# Altium schematic sheet MotorCellTwo.SchDoc: ODRIVE-FOC
size A3; DocumentNumber: SEASKY; Revision: V1.1
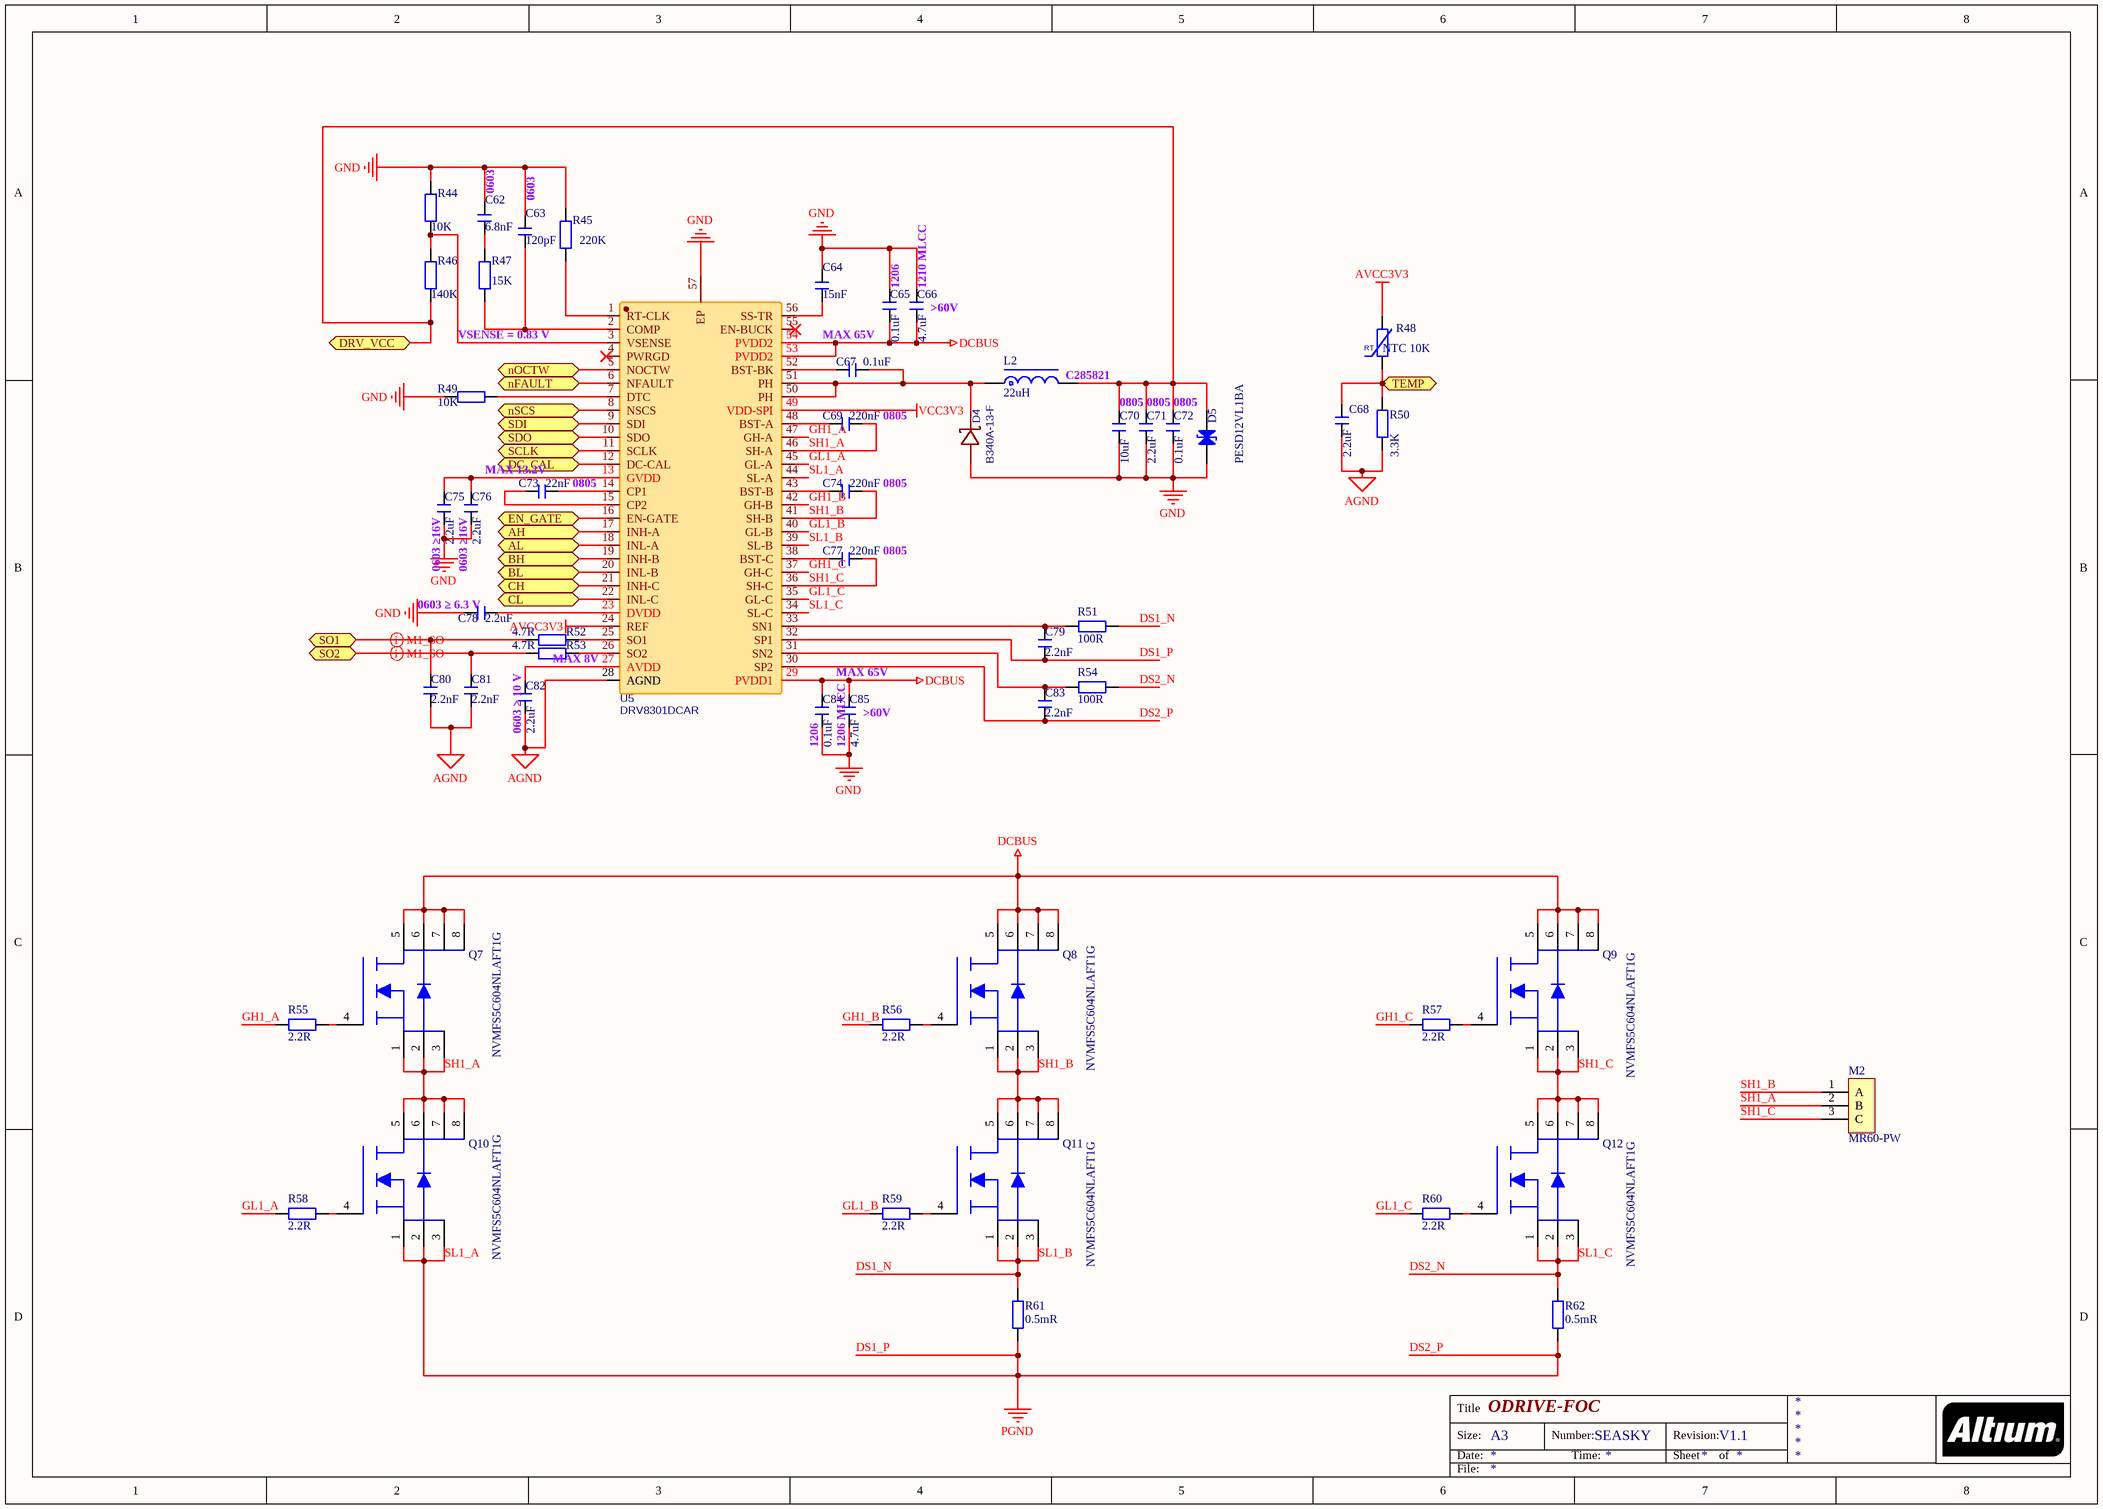
[diagram p0: MotorCellTwo.SchDoc]

## Parts
C62  6.8nF  [C 0603_L]
C63  120pF  [C 0603_L]
C64  15nF  [C 0603_L]
C65  0.1uF  [C 1206_L]
C66  4.7uF  [C 1210_L]
C67  0.1uF  [C 0603_L]
C68  2.2uF  [C 0603_L]
C69  220nF  [C 0805_L]
C70  10uF  [C 0805_L]
C71  2.2uF  [C 0805_L]
C72  0.1uF  [C 0805_L]
C73  22nF  [C 0805_L]
C74  220nF  [C 0805_L]
C75  2.2uF  [C 0603_L]
C76  2.2uF  [C 0603_L]
C77  220nF  [C 0805_L]
C78  2.2uF  [C 0603_L]
C79  2.2nF  [C 0603_L]
C80  2.2nF  [C 0603_L]
C81  2.2nF  [C 0603_L]
C82  2.2uF  [C 0603_L]
C83  2.2nF  [C 0603_L]
C84  0.1uF  [C 1206_L]
C85  4.7uF  [C 1210_L]
D4  B340A-13-F  [SMA_L4.4-W2.6-LS5.0-RD]
D5  PESD12VL1BA  [SOD-323]
L2  22uH  [CD53]
M2  MR60-PW  [MR60-PW]
Q7  NVMFS5C604NLAFT1G  [PG-TDSON-8_L5.0-W6.0-P1.27-LS6.2-BL-EP]
Q8  NVMFS5C604NLAFT1G  [PG-TDSON-8_L5.0-W6.0-P1.27-LS6.2-BL-EP]
Q9  NVMFS5C604NLAFT1G  [PG-TDSON-8_L5.0-W6.0-P1.27-LS6.2-BL-EP]
Q10  NVMFS5C604NLAFT1G  [PG-TDSON-8_L5.0-W6.0-P1.27-LS6.2-BL-EP]
Q11  NVMFS5C604NLAFT1G  [PG-TDSON-8_L5.0-W6.0-P1.27-LS6.2-BL-EP]
Q12  NVMFS5C604NLAFT1G  [PG-TDSON-8_L5.0-W6.0-P1.27-LS6.2-BL-EP]
R44  10K  [R 0603_L]
R45  220K  [R 0603_L]
R46  140K  [R 0603_L]
R47  15K  [R 0603_L]
R48  NTC 10K  [R 0805-HP_L]
R49  10K  [R 0603_L]
R50  3.3K  [R 0805_L]
R51  100R  [R 0603_L]
R52  4.7R  [R 0603_L]
R53  4.7R  [R 0603_L]
R54  100R  [R 0603_L]
R55  2.2R  [R 0603_L]
R56  2.2R  [R 0603_L]
R57  2.2R  [R 0603_L]
R58  2.2R  [R 0603_L]
R59  2.2R  [R 0603_L]
R60  2.2R  [R 0603_L]
R61  0.5mR  [R3920]
R62  0.5mR  [R3920]
U5  DRV8301DCAR  [HTSSOP-56_L14.0-W6.0-P0.50-LS8.0-BL]

## Ports
AH (bidir), AL (bidir), BH (bidir), BL (bidir), CH (bidir), CL (bidir), DC_CAL (bidir), DRV_VCC (bidir), EN_GATE (bidir), nFAULT (bidir), nOCTW (bidir), nSCS (bidir), SCLK (bidir), SDI (bidir), SDO (bidir), SO1 (bidir), SO2 (bidir), TEMP (bidir)

## Nets
AGND: C68.2 C80.1 C81.1 C82.1 R50.1 U5.28(AGND)
AVCC3V3: R48.2 U5.24(REF)
DCBUS: C65.1 C66.1 C84.2 C85.2 Q7.5 Q7.6 Q7.7 Q7.8 Q8.5 Q8.6 Q8.7 Q8.8 Q9.5 Q9.6 Q9.7 Q9.8 U5.29(PVDD1) U5.53(PVDD2) U5.54(PVDD2)
DS1_P: C79.1 C83.1 Q10.1 Q10.2 Q10.3 R61.1 R62.1 U5.30(SP2) U5.32(SP1) U5.44(SL-A)  [also labelled DS2_P, PGND, SL1_A]
GND: C62.1 C63.1 C64.1 C65.2 C66.2 C70.1 C71.1 C72.1 C75.1 C76.1 C78.1 C84.1 C85.1 D4.2(A) D5.2(K) R44.2 R45.2 R49.2 U5.57(EP)
VCC3V3: U5.49(VDD-SPI)
AH: U5.17(INH-A) ; port AH
AL: U5.18(INL-A) ; port AL
BH: U5.19(INH-B) ; port BH
BL: U5.20(INL-B) ; port BL
CH: U5.21(INH-C) ; port CH
CL: U5.22(INL-C) ; port CL
DC_CAL: U5.12(DC-CAL) ; port DC_CAL
DRV_VCC: C70.2 C71.2 C72.2 D5.1(A) L2.2 R46.1 ; port DRV_VCC
DS1_N: Q11.1 Q11.2 Q11.3 R51.2 R61.2 U5.39(SL-B)  [also labelled SL1_B]
DS2_N: Q12.1 Q12.2 Q12.3 R54.2 R62.2 U5.34(SL-C)  [also labelled SL1_C]
EN_GATE: U5.16(EN-GATE) ; port EN_GATE
GH1_A: R55.1 U5.47(GH-A)
GH1_B: R56.1 U5.42(GH-B)
GH1_C: R57.1 U5.37(GH-C)
GL1_A: R58.1 U5.45(GL-A)
GL1_B: R59.1 U5.40(GL-B)
GL1_C: R60.1 U5.35(GL-C)
nFAULT: U5.6(NFAULT) ; port nFAULT
nOCTW: U5.5(NOCTW) ; port nOCTW
nSCS: U5.8(NSCS) ; port nSCS
SCLK: U5.11(SCLK) ; port SCLK
SDI: U5.9(SDI) ; port SDI
SDO: U5.10(SDO) ; port SDO
SH1_A: C69.2 M2.2(B) Q7.1 Q7.2 Q7.3 Q10.5 Q10.6 Q10.7 Q10.8 U5.46(SH-A)
SH1_B: C74.2 M2.1(A) Q8.1 Q8.2 Q8.3 Q11.5 Q11.6 Q11.7 Q11.8 U5.41(SH-B)
SH1_C: C77.2 M2.3(C) Q9.1 Q9.2 Q9.3 Q12.5 Q12.6 Q12.7 Q12.8 U5.36(SH-C)
SO1: C80.2 R52.1 ; port SO1
SO2: C81.2 R53.1 ; port SO2
TEMP: C68.1 R48.1 R50.2 ; port TEMP
NetC62_2: C62.2 R47.2
NetC63_2: C63.2 R47.1 U5.2(COMP)
NetC64_2: C64.2 U5.56(SS-TR)
NetC67_1: C67.1 D4.1(K) L2.1 U5.50(PH) U5.51(PH)
NetC67_2: C67.2 U5.52(BST-BK)
NetC69_1: C69.1 U5.48(BST-A)
NetC73_1: C73.1 U5.14(CP1)
NetC73_2: C73.2 U5.15(CP2)
NetC74_1: C74.1 U5.43(BST-B)
NetC75_2: C75.2 C76.2 U5.13(GVDD)
NetC77_1: C77.1 U5.38(BST-C)
NetC78_2: C78.2 U5.23(DVDD)
NetC79_2: C79.2 R51.1 U5.33(SN1)
NetC82_2: C82.2 U5.27(AVDD)
NetC83_2: C83.2 R54.1 U5.31(SN2)
NetQ7_4: Q7.4 R55.2
NetQ8_4: Q8.4 R56.2
NetQ9_4: Q9.4 R57.2
NetQ10_4: Q10.4 R58.2
NetQ11_4: Q11.4 R59.2
NetQ12_4: Q12.4 R60.2
NetR44_1: R44.1 R46.2 U5.3(VSENSE)
NetR45_1: R45.1 U5.1(RT-CLK)
NetR49_1: R49.1 U5.7(DTC)
NetR52_2: R52.2 U5.25(SO1)
NetR53_2: R53.2 U5.26(SO2)

Not connected (* = marked no-connect by the designer): U5 4(PWRGD)* 55(EN-BUCK)*

## Layout directives
differential pair: SO1, SO2

## Notes on the sheet
- (near C62) 0603
- 0603
- 1206
- (near C66) >60V
- (near C66) 1210 MLCC
- VSENSE = 0.83 V
- MAX 65V
- (near L2) C285821
- 0805
- (near C73) MAX 13.2V
- (near C74) 0805
- (near C75) 0603 ≥16V
- (near C76) 0603 ≥16V
- (near C77) 0805
- (near C78) 0603 ≥ 6.3 V
- (near R53) MAX 8V
- (near C85) >60V
- (near C82) 0603 ≥ 10 V
- (near C84) 1206
- (near C85) 1206 MLCC
- Title
- Size:
- Date:
- A3
- Number:
- Time:
- Revision:
- Sheet
- of
- File:

## Library data of the parts
C62-C85 = C: 贴片电容
D4 = B340A-13-F: BOM_Manufacturer: DIODES; SMT Type: Extend; BOM_Supplier: LCSC; BOM_Manufacturer Part: B340A-13-F; BOM_Supplier Part: C85098; BOM_JLCPCB SMD: Yes; spicePre: D; spiceSymbolName: B340A-13-F
D5 = PESD5V0S1BA: PESD5V0S1BA、ESD二极管、5V
L2 = L-SMD: CD系列贴片线绕功率电感
Q7-Q12 = BSC037N08NS5ATMA1
R44-R47 R49-R60 = R: 贴片电阻
R48 = RT: 热敏电阻
R61 R62 = R-Precision: 精密贴片电阻
U5 = DRV8301DCAR: BOM_Manufacturer: Texas Instruments; Contributor: LCSC; SMT Type: Extend; BOM_Supplier: LCSC; BOM_Supplier Part: C98969; BOM_Manufacturer Part: DRV8301DCAR; BOM_JLCPCB SMD: Yes; spicePre: U; spiceSymbolName: DRV8301DCAR